# Altium schematic sheet Sheet.SchDoc
size A4; SheetNumber: 1; SheetTotal: 1
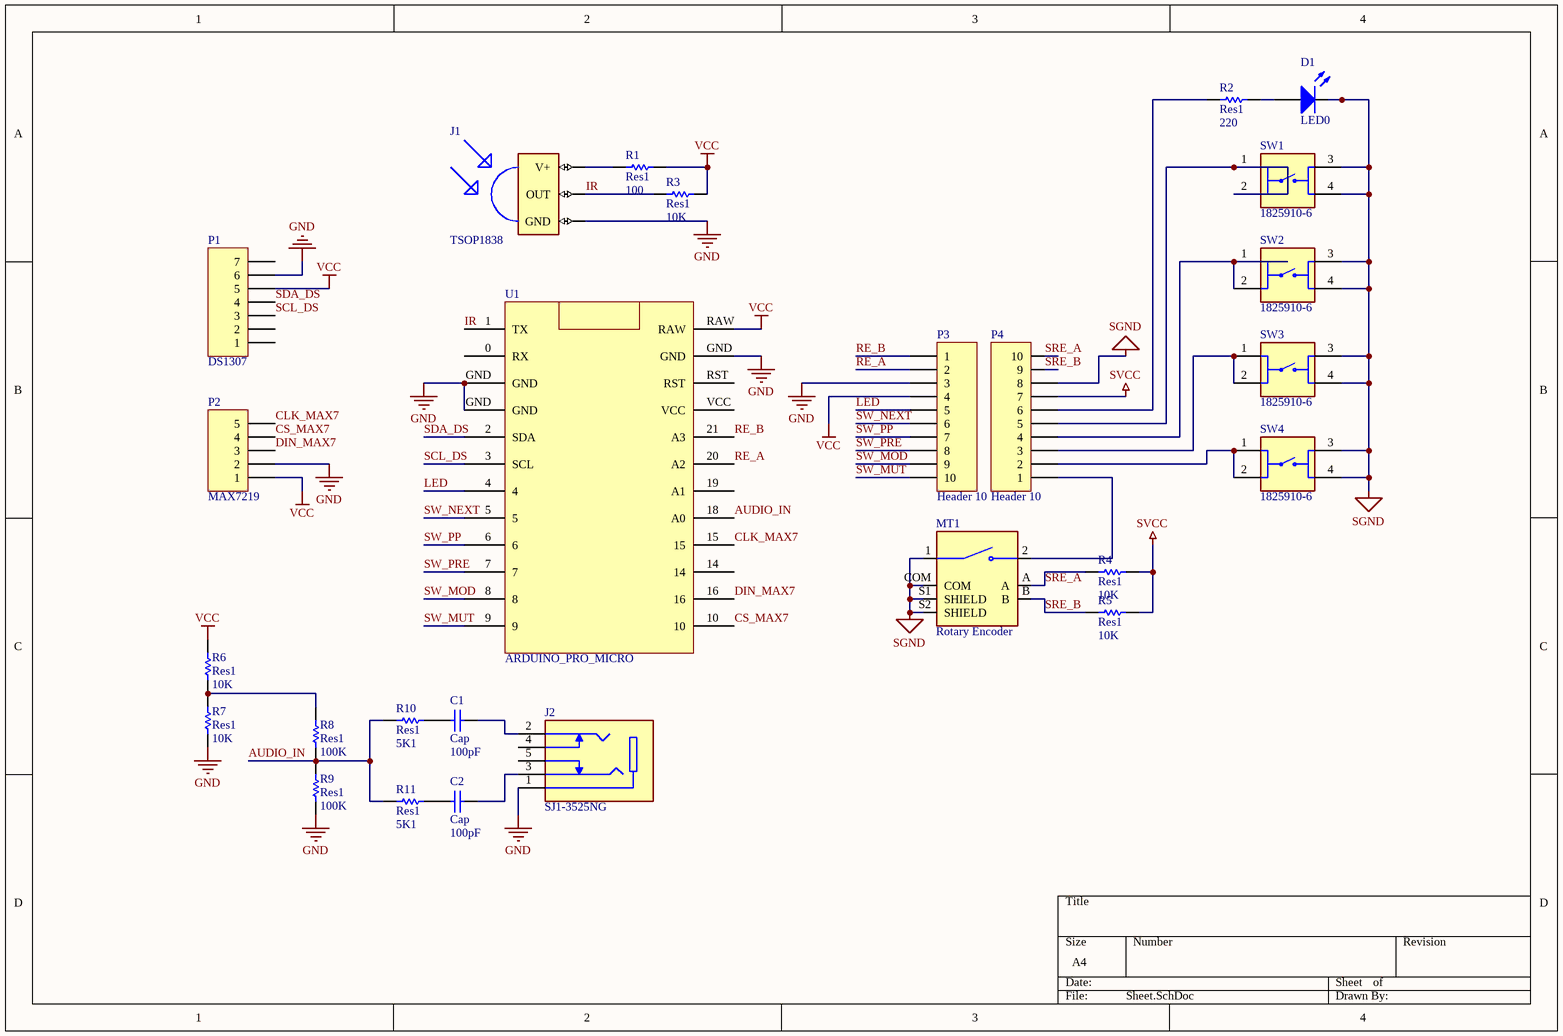
[diagram p0: Sheet.SchDoc]

## Parts
C1  Cap  value 100pF  [RAD-0.3]
C2  Cap  value 100pF  [RAD-0.3]
D1  LED0  [LED-0]
J1  TSOP1838  [TSOP18XX]
J2  SJ1-3525NG  [CUI_SJ1-3525NG]
MT1  Rotary Encoder  [XDCR_PEC11R-4215F-S0024]
P1  DS1307  [HDR1X7]
P2  MAX7219  [HDR1X5]
P3  Header 10  [HDR1X10]
P4  Header 10  [HDR1X10]
R1  Res1  value 100  [RESC3116X65N]
R2  Res1  value 220  [RESC3116X65N]
R3  Res1  value 10K  [RESC3116X65N]
R4  Res1  value 10K  [RESC3116X65N]
R5  Res1  value 10K  [RESC3116X65N]
R6  Res1  value 10K  [RESC3116X65N]
R7  Res1  value 10K  [RESC3116X65N]
R8  Res1  value 100K  [RESC3116X65N]
R9  Res1  value 100K  [RESC3116X65N]
R10  Res1  value 5K1  [RESC3116X65N]
R11  Res1  value 5K1  [RESC3116X65N]
SW1  1825910-6  [SW_1825910-6-4]
SW2  1825910-6  [SW_1825910-6-4]
SW3  1825910-6  [SW_1825910-6-4]
SW4  1825910-6  [SW_1825910-6-4]
U1  ARDUINO_PRO_MICRO  [MODULE_ARDUINO_PRO_MINI]

## Nets
GND: J1.GND J2.1 P1.6 P2.2 P3.3 R7.1 R9.1 U1.GND
SGND: D1.2(K) MT1.1 MT1.COM MT1.S1(SHIELD) MT1.S2(SHIELD) P4.8 SW1.3 SW1.4 SW2.3 SW2.4 SW3.3 SW3.4 SW4.3 SW4.4
SVCC: P4.7 R4.2 R5.2
VCC: P1.5 P2.1 P3.4 R1.2 R3.2 R6.2 U1.RAW
AUDIO_IN: R8.2 R9.2 R10.1 R11.1 U1.18(A0)
CLK_MAX7: P2.5 U1.15
CS_MAX7: P2.4 U1.10
DIN_MAX7: P2.3 U1.16
IR: J1.OUT R3.1 U1.1(TX)
LED: P3.5 U1.4
RE_A: P3.2 U1.20(A2)
RE_B: P3.1 U1.21(A3)
SCL_DS: P1.3 U1.3(SCL)
SDA_DS: P1.4 U1.2(SDA)
SRE_A: MT1.A P4.10 R4.1
SRE_B: MT1.B P4.9 R5.1
SW_MOD: P3.9 U1.8
SW_MUT: P3.10 U1.9
SW_NEXT: P3.6 U1.5
SW_PP: P3.7 U1.6
SW_PRE: P3.8 U1.7
NetC1_1: C1.1 R10.2
NetC1_2: C1.2 J2.2
NetC2_1: C2.1 R11.2
NetC2_2: C2.2 J2.3
NetD1_1: D1.1(A) R2.2
NetJ1_VCC: J1.VCC(V+) R1.1
NetMT1_2: MT1.2 P4.1
NetP4_2: P4.2 SW4.1 SW4.2
NetP4_3: P4.3 SW3.1 SW3.2
NetP4_4: P4.4 SW2.1 SW2.2
NetP4_5: P4.5 SW1.1 SW1.2
NetP4_6: P4.6 R2.1
NetR6_1: R6.1 R7.2 R8.1

Not connected (* = marked no-connect by the designer): J2 4 5; P1 1 2 7; U1 0(RX) 14 19(A1) RST VCC

## Library data of the parts
C1 C2 = Cap: Capacitor; Published: 8-Jun-2000; LatestRevisionDate: 17-Jul-2002; LatestRevisionNote: Re-released for DXP Platform.; PackageReference: RAD-0.3; Publisher: Altium Limited; PackageDescription: Radial Cap, Thru-Hole; 2 Leads; 0.3 in Pin Spacing
D1 = LED0: Typical INFRARED GaAs LED; Published: 8-Jun-2000; LatestRevisionDate: 08-Jul-2005; LatestRevisionNote: Mech Layer 1 removed.; PackageReference: LED-0; Publisher: Altium Limited; PackageDescription: LED; 2 Leads
J1 = TSOP1838: IR Receiver and Demodulator; Value: *; MP: TSOP1838; Package: None; Availability: Unavailable; Price: None
J2 = SJ1-3525NG: 3.5 mm Right-Angle Stereo Jack, 5 Pin PCB Mount, Isolated Ground; Value: *; Availability: Unavailable; Price: None; MP: SJ1-3525NG; Package: None
MT1 = PEC11R-4215F-S0024: Incremental Encoder, 12 Mm, Contact Rating 10 Ma - 5 Vdc; Price: None; Availability: Unavailable; MP: PEC11R-4215F-S0024; Value: *; Package: None
P1 = Header 7: Header, 7-Pin; LatestRevisionDate: 17-Jul-2002; LatestRevisionNote: Re-released for DXP Platform.; Publisher: Altium Limited
P2 = Header 5: Header, 5-Pin; LatestRevisionDate: 17-Jul-2002; LatestRevisionNote: Re-released for DXP Platform.; Publisher: Altium Limited
P3 P4 = Header 10: Header, 10-Pin; LatestRevisionDate: 17-Jul-2002; LatestRevisionNote: Re-released for DXP Platform.; Publisher: Altium Limited
R1-R11 = Res1: Resistor; Published: 8-Jun-2000; LatestRevisionDate: 17-Jul-2002; LatestRevisionNote: Re-released for DXP Platform.; PackageReference: AXIAL-0.3; Publisher: Altium Limited; PackageDescription: Axial Device, Thru-Hole; 2 Leads; 0.3 in Pin Spacing
SW1-SW4 = 1825910-6: Switch Push Button OFF (ON) SPST Round Button 0.05A 24VDC Momentary Contact PC Pins Thru-Hole; MF: TE Connectivity; Value: *; MP: 1825910-6; Package: None; Check_prices: https://www.snapeda.com/parts/1825910-6/TE+Connectivity+ALCOSWITCH+Switches/view-part/?ref=eda; SnapEDA_Link: https://www.snapeda.com/parts/1825910-6/TE+Connectivity+ALCOSWITCH+Switches/view-part/?ref=snap; Digi-Key_Part_Number: 450-1650-ND; Purchase-URL: https://pricing.snapeda.com/search/part/1825910-6/?ref=eda
U1 = ARDUINO_PRO_MICRO: This board was developed for applications and installations where space is premium and projects are made as permanent set ups. Small, available in 3.3 V and 5 V versions, powered by ATmega328P.; MP: Arduino Pro Mini; SnapEDA_Link: https://www.snapeda.com/parts/Arduino%20Pro%20Mini/Arduino/view-part/?ref=snap; Package: None; Value: *; MF: Arduino; Check_prices: https://www.snapeda.com/parts/Arduino%20Pro%20Mini/Arduino/view-part/?ref=eda